# Altium schematic sheet Power.SchDoc (part 1 of 2)
size A4; SheetNumber: 3; SheetTotal: 7
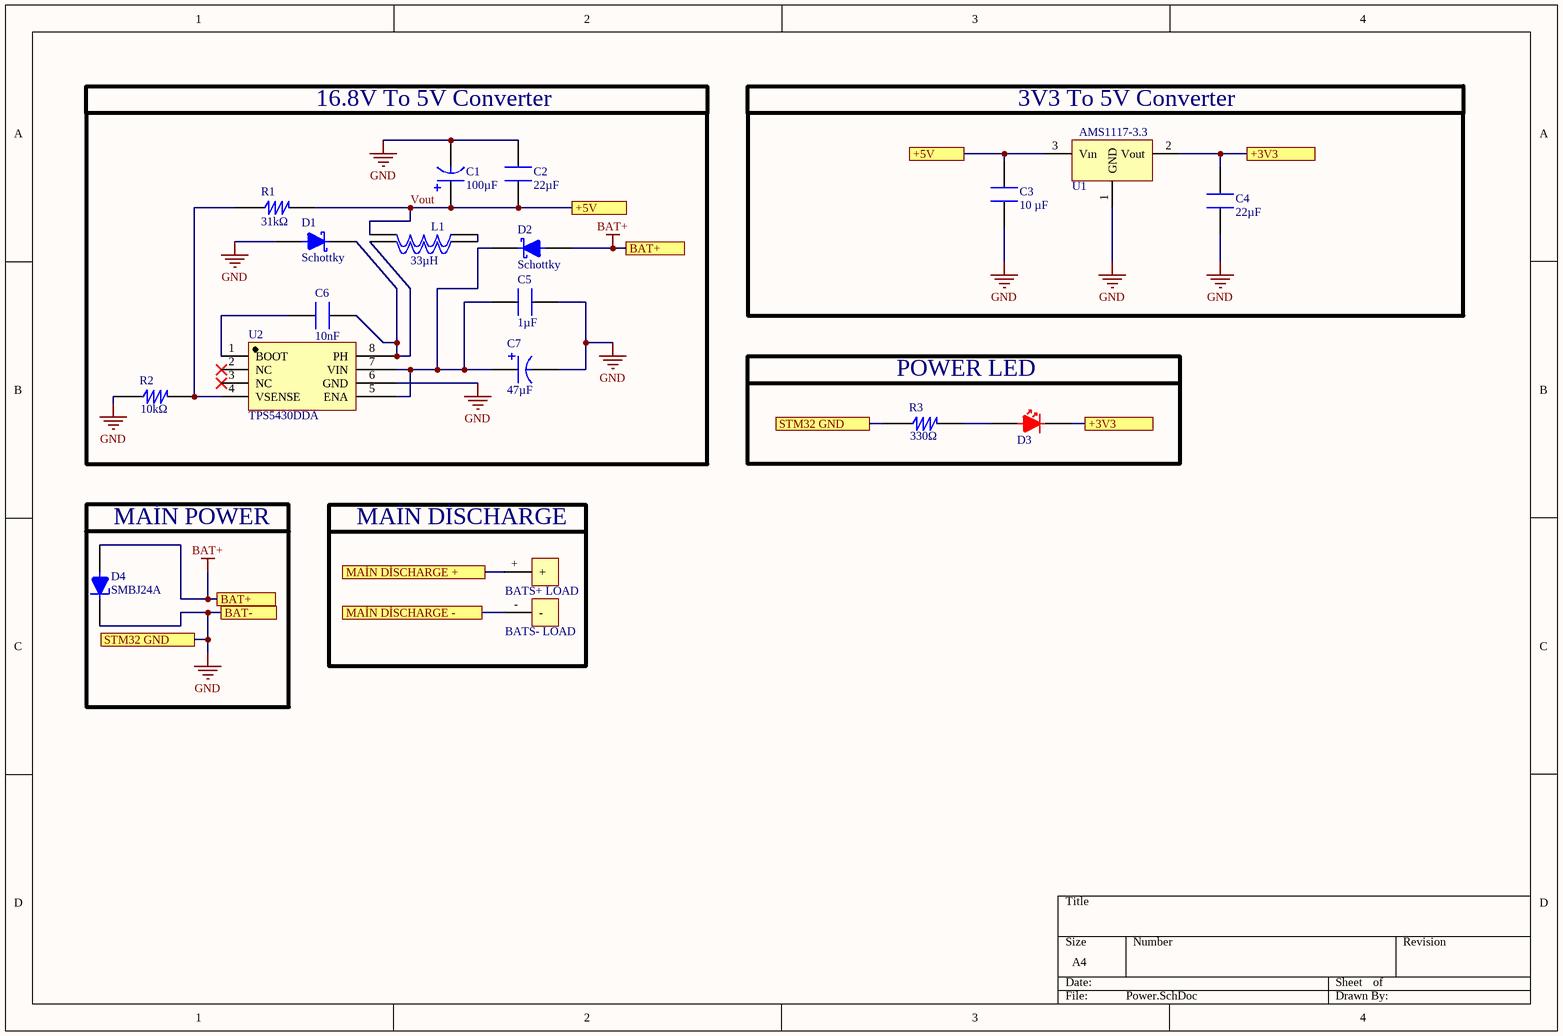
[diagram p0: Power.SchDoc]

## Parts
BATS+_LOAD  BATTERY + 1S  [BATTERY +1S]  (value not drawn)
BATS-_LOAD  BATTERY -1S  [BATTERY -1S]  (value not drawn)
C1  value 100µF  [CAP_EEE-1AA101WR]  (hidden comment: EEE-1AA101WR)
C2  value 22µF  [CAP CER 1210]  (hidden comment: C1210C226J8RACTU)
C3  Capacitance: 10 µF  [CAP CER 0805]  (hidden comment: 0805W106K500CC)
C4  value 22µF  [CAP CER 1210]  (hidden comment: C1210C226J8RACTU)
C5  value 1µF  [CAP CER 0805]  (hidden comment: CL21B105KBFNNNE)
C6  value 10nF  [CAP CER 0603]  (hidden comment: C0603C103J5RACTU)
C7  value 47µF  [CAP_EEE-FK1E470P]  (hidden comment: EEE-FK1E470P)
D1  Technology: Schottky  [DO-214AC (SMA)]  (hidden comment: SS54)
D2  Technology: Schottky  [DO-214AC (SMA)]  (hidden comment: SS54)
D3  LTST-C190KRKT  [LED 0603]  (value not drawn)
D4  SMBJ24A  [SMBJ24A]
L1  value 33µH  [SRF0703 Series INDUCTOR]  (hidden comment: SRF0703-330M)
R1  value 31kΩ  [RES 2010]  (hidden comment: Y162731K0000T9R)
R2  value 10kΩ  [RES 0603]  (hidden comment: RMCF0603FT10K0)
R3  value 330Ω  [RES 0603]  (hidden comment: CRG0603F330R)
U1  AMS1117-3.3  [SOT-223-3L]
U2  TPS5430DDA  [8SOPWR]

## Blocks framed on the sheet
16.8V To 5V Converter: C1 C2 C5-C7 D1 D2 L1 R1 R2 U2
3V3 To 5V Converter: C3 C4 U1
MAİN POWER: D4

## Ports
+3V3 (see COM[1C], COM[3C], COM[3D], COM[4B], ESP32 and Flash[2A], ESP32 and Flash[3A], MCU[2A], MCU[2B], MCU[3A], MCU[3B], MCU[3D], Power[3B]), +3V3 (see COM[1C], COM[3C], COM[3D], COM[4B], ESP32 and Flash[2A], ESP32 and Flash[3A], MCU[2A], MCU[2B], MCU[3A], MCU[3B], MCU[3D], Power[4A]), +5V (see COM[2D], Power[2A]), +5V (see COM[2D], Power[3A]), BAT+ (see AFE and MOSFETs[1B], AFE and MOSFETs[1C], AFE and MOSFETs[2B], Power[1C]), BAT+ (see AFE and MOSFETs[1B], AFE and MOSFETs[1C], AFE and MOSFETs[2B], Power[2A]), BAT- (see AFE and MOSFETs[2A]), MAİN DİSCHARGE + (see AFE and MOSFETs[4D]), MAİN DİSCHARGE - (see AFE and MOSFETs[3A]), STM32 GND (see COM[1B], COM[1D], COM[2C], COM[2D], COM[3B], COM[4D], ESP32 and Flash[2C], MCU[3A], MCU[3D], MCU[4B], Power[1C]), STM32 GND (see COM[1B], COM[1D], COM[2C], COM[2D], COM[3B], COM[4D], ESP32 and Flash[2C], MCU[3A], MCU[3D], MCU[4B], Power[2B])

## Nets
BAT+: D2.1 D4.1 ; port BAT+
GND: C1.2 C2.2 C3.2 C4.2 C5.2 C7.2 D1.1 D4.2 R2.1 R3.1 U1.1(GND) U2.6(GND) ; port STM32 GND, port BAT-
+3V3: C4.1 D3.2 U1.2(Vout) ; port +3V3
MAİN DİSCHARGE +: BATS+_LOAD.+ ; port MAİN DİSCHARGE +
MAİN DİSCHARGE -: BATS-_LOAD.- ; port MAİN DİSCHARGE -
Vout: C1.1 C2.1 C3.1 L1.1 R1.2 U1.3(Vın) ; port +5V
NetC5_1: C5.1 C7.1 D2.2 U2.5(ENA) U2.7(VIN)
NetC6_1: C6.1 D1.2 L1.2 U2.8(PH)
NetC6_2: C6.2 U2.1(BOOT)
NetD3_1: D3.1 R3.2
NetR1_1: R1.1 R2.2 U2.4(VSENSE)

Not connected (* = marked no-connect by the designer): L1 3; U2 2(NC)* 3(NC)*

## Notes on the sheet
- POWER LED
- (near BATS+_LOAD) MAİN DİSCHARGE
## Library data of the parts
BATS+_LOAD = BATTERY + 1S: battery + pad
BATS-_LOAD = BATTERY -1S: battery - pad
C1 = CAP ALUM 100UF 10V: CAP ALUM 100UF 20% 10V SMD; Manufacturer: Panasonic; Dissipation Factor: 30%; Leakage Current: 10µA; Life (Hours): 1000hours; Ripple Current: 50mA; Supplier: Arrow Electronics; Supplier Part Number: EEE-1AA101WR; Manufacturer Part Number: EEE-1AA101WR; RoHS: Compliant; Category: Aluminum Electrolytic Capacitors; Stock: 26000; Pricing: 1000=0,0647 (USD); Case/Package: Radial; Contact Plating: Tin; Diameter: 5mm; Height: 5.4mm; Height - Seated (Max): 5.4102mm; Lead Free: Lead Free; Length: 5.3mm; Lifecycle Status: NRND; Max Operating Temperature: 85°C; Min Operating Temperature: -40°C; Mounting Technology: Surface Mount; Number of Terminals: 2; Packaging: Cut Tape; Radiation Hardening: No; REACH SVHC: Yes; Ripple Current (AC): 50mA; Schedule B: 8532220020, 8532220020|8532220020|8532220020|8532220020|8532220020; Termination: SMD/SMT; Tolerance: 20%; Voltage Rating: 10V; Voltage Rating (DC): 10V; Width: 5.3mm; ComponentLink1URL: https://datasheet.octopart.com:443/EEE-1AA101WR-Panasonic-datasheet-62330071.pdf?src-supplier=Newark; ComponentLink1Description: https://datasheet.octopart.com:443/EEE-1AA101WR-Panasonic-datasheet-62330071.pdf?src-supplier=Newark; ComponentLink2URL: https://datasheet.octopart.com:443/EEE-1AA101WR-Panasonic-datasheet-5314063.pdf?src-supplier=Newark; ComponentLink2Description: https://datasheet.octopart.com:443/EEE-1AA101WR-Panasonic-datasheet-5314063.pdf?src-supplier=Newark; ComponentLink3URL: https://datasheet.octopart.com:443/EEE-1AA101WR-Panasonic-datasheet-41169183.pdf?src-supplier=Newark; ComponentLink3Description: https://datasheet.octopart.com:443/EEE-1AA101WR-Panasonic-datasheet-41169183.pdf?src-supplier=Newark; ComponentLink4URL: https://datasheet.octopart.com:443/EEE-1AA101WR-Panasonic-datasheet-13265900.pdf?src-supplier=RS+(Formerly+Allied+Electronics); ComponentLink4Description: https://datasheet.octopart.com:443/EEE-1AA101WR-Panasonic-datasheet-13265900.pdf?src-supplier=RS+(Formerly+Allied+Electronics); ComponentLink5URL: https://datasheet.octopart.com:443/EEE-1AA101WR-Panasonic-datasheet-34230028.pdf?src-supplier=element14+APAC; ComponentLink5Description: https://datasheet.octopart.com:443/EEE-1AA101WR-Panasonic-datasheet-34230028.pdf?src-supplier=element14+APAC; ComponentLink6URL: https://datasheet.octopart.com:443/EEE-1AA101WR-Panasonic-datasheet-154766114.pdf?src-supplier=Master+Electronics; ComponentLink6Description: https://datasheet.octopart.com:443/EEE-1AA101WR-Panasonic-datasheet-154766114.pdf?src-supplier=Master+Electronics; ComponentLink7URL: https://datasheet.octopart.com:443/EEE-1AA101WR-Panasonic-datasheet-11548988.pdf?src-supplier=Arrow+Electronics; ComponentLink7Description: https://datasheet.octopart.com:443/EEE-1AA101WR-Panasonic-datasheet-11548988.pdf?src-supplier=Arrow+Electronics; ComponentLink8URL: https://datasheet.octopart.com:443/EEE1AA101WR-Panasonic-datasheet-150469818.pdf?src-supplier=TME; ComponentLink8Description: https://datasheet.octopart.com:443/EEE1AA101WR-Panasonic-datasheet-150469818.pdf?src-supplier=TME; ComponentLink9URL: https://sigma.octopart.com:443/150570760/technical_drawing/Panasonic-EEE1AA101WR.pdf?src-supplier=Panasonic+SCT; ComponentLink9Description: https://sigma.octopart.com:443/150570760/technical_drawing/Panasonic-EEE1AA101WR.pdf?src-supplier=Panasonic+SCT; ComponentLink10URL: https://datasheet.octopart.com:443/EEE-1AA101WR-Panasonic-datasheet-6019.pdf?src-supplier=DigiKey; ComponentLink10Description: https://datasheet.octopart.com:443/EEE-1AA101WR-Panasonic-datasheet-6019.pdf?src-supplier=DigiKey
C2 C4 = CAP CER 22UF 10V 1210: CAP CER 22UF 10V X7R 1210; Manufacturer: KEMET; Dielectric Material: Ceramic; Tolerance: 5%; Supplier: Arrow Electronics; Supplier Part Number: C1210C226J8RACTU; Manufacturer Part Number: C1210C226J8RACTU; RoHS: Compliant; Category: Ceramic Capacitors; Pricing: 1000=2,466, 2000=2,456, 3000=2,445, 4000=2,434, 5000=2,422, 6000=2,411, 10000=2,4, 20000=2,388, 50000=2,376 (USD); Case/Package: 1210; China RoHS: Compliant; Dielectric: X7R; Height: 2.5mm; Length: 3.2mm; Lifecycle Status: Production; Max Operating Temperature: 125°C; Min Operating Temperature: -55°C; Mounting Technology: Surface Mount; Number of Terminals: 2; REACH SVHC: Yes; Voltage Rating (DC): 10V; Width: 2.5mm; ComponentLink1URL: https://datasheet.octopart.com:443/C1210C226J8RACTU-KEMET-datasheet-178445679.pdf?src-supplier=IHS; ComponentLink1Description: https://datasheet.octopart.com:443/C1210C226J8RACTU-KEMET-datasheet-178445679.pdf?src-supplier=IHS; ComponentLink2URL: https://datasheet.octopart.com/C1210C226J8RACTU-KEMET-datasheet-84169754.pdf; ComponentLink2Description: https://datasheet.octopart.com/C1210C226J8RACTU-KEMET-datasheet-84169754.pdf
C3 = CAP CER 10UF 50V 0805: 10 µF ±10% 50V Ceramic Capacitor X5R 0805 (2012 Metric); Series: 0805; Voltage - Rated: 50V; Tolerance: ±10%; Temperature Coefficient: X5R; Operating Temperature: -55°C ~ 85°C; Mounting Type: Surface Mount, MLCC; Package / Case: 0805 (2012 Metric); Size / Dimension: 0.079" L x 0.049" W (2.00mm x 1.25mm); Thickness (Max): 0.057" (1.45mm); ComponentLink1Description: Datasheet; ComponentLink1URL: https://mm.digikey.com/Volume0/opasdata/d220001/medias/docus/5660/3372_0805W106K500CC.pdf; ComponentLink2Description: Supplier Link; ComponentLink2URL: https://www.digikey.com/en/products/detail/nextgen-components/0805W106K500CC/18677029
C5 = CAP CER 1UF 50V 0805: CAP CER 1UF 50V X7R 0805; Manufacturer: Samsung Electro-Mechanics; Dielectric Material: Ceramic; Tolerance: 10%; Supplier: Arrow Electronics; Supplier Part Number: CL21B105KBFNNNE; Manufacturer Part Number: CL21B105KBFNNNE; RoHS: Compliant; Category: Ceramic Capacitors; Stock: 4546000; Pricing: 10000=0,0106 (USD); Case/Package: 0805; Case Code (Imperial): 0805; Case Code (Metric): 2012; China RoHS: Compliant; Depth: 1.25mm; Dielectric: X7R; Height: 1.35mm; Length: 2mm; Lifecycle Status: Production; Material: Ceramic; Max Operating Temperature: 125°C; Min Operating Temperature: -55°C; Mounting Technology: Surface Mount; Number of Terminals: 2; Radiation Hardening: No; REACH SVHC: Yes; Schedule B: 8532240020, 8532240020|8532240020, 8532240020|8532240020|8532240020, 8532240020|8532240020|8532240020|8532240020; Thickness: 1.3462mm; Voltage: 50V; Voltage Rating: 50V; Voltage Rating (DC): 50V; Width: 1.25mm; ComponentLink1URL: https://datasheet.octopart.com:443/CL21B105KBFNNNE-Samsung-Electro-Mechanics-datasheet-136482495.pdf?src-supplier=IHS; ComponentLink1Description: https://datasheet.octopart.com:443/CL21B105KBFNNNE-Samsung-Electro-Mechanics-datasheet-136482495.pdf?src-supplier=IHS; ComponentLink2URL: https://datasheet.octopart.com:443/CL21B105KBFNNNE-Samsung-Electro-Mechanics-datasheet-11733377.pdf?src-supplier=Future+Electronics; ComponentLink2Description: https://datasheet.octopart.com:443/CL21B105KBFNNNE-Samsung-Electro-Mechanics-datasheet-11733377.pdf?src-supplier=Future+Electronics; ComponentLink3URL: https://datasheet.octopart.com:443/CL21B105KBFNNNE-Samsung-Electro-Mechanics-datasheet-116891038.pdf?src-supplier=Future+Electronics; ComponentLink3Description: https://datasheet.octopart.com:443/CL21B105KBFNNNE-Samsung-Electro-Mechanics-datasheet-116891038.pdf?src-supplier=Future+Electronics; ComponentLink4URL: https://datasheet.octopart.com:443/CL21B105KBFNNNE-Samsung-Electro-Mechanics-datasheet-81462183.pdf?src-supplier=Future+Electronics; ComponentLink4Description: https://datasheet.octopart.com:443/CL21B105KBFNNNE-Samsung-Electro-Mechanics-datasheet-81462183.pdf?src-supplier=Future+Electronics; ComponentLink5URL: https://datasheet.octopart.com:443/CL21B105KBFNNNE-Samsung-datasheet-48647582.pdf?src-supplier=Future+Electronics; ComponentLink5Description: https://datasheet.octopart.com:443/CL21B105KBFNNNE-Samsung-datasheet-48647582.pdf?src-supplier=Future+Electronics; ComponentLink6URL: https://datasheet.octopart.com:443/CL21B105KBFNNNE-Samsung-datasheet-8326294.pdf?src-supplier=Future+Electronics; ComponentLink6Description: https://datasheet.octopart.com:443/CL21B105KBFNNNE-Samsung-datasheet-8326294.pdf?src-supplier=Future+Electronics; ComponentLink7URL: https://datasheet.octopart.com:443/CL21B105KBFNNNE-Samsung-Electro-Mechanics-datasheet-149045959.pdf?src-supplier=Future+Electronics; ComponentLink7Description: https://datasheet.octopart.com:443/CL21B105KBFNNNE-Samsung-Electro-Mechanics-datasheet-149045959.pdf?src-supplier=Future+Electronics; ComponentLink8URL: https://datasheet.octopart.com/CL21B105KBFNNNE-Samsung-Electro-Mechanics-datasheet-97040617.pdf; ComponentLink8Description: https://datasheet.octopart.com/CL21B105KBFNNNE-Samsung-Electro-Mechanics-datasheet-97040617.pdf; ComponentLink9URL: https://datasheet.octopart.com/CL21B105KBFNNNE-Samsung-Electro-Mechanics-datasheet-8324245.pdf; ComponentLink9Description: https://datasheet.octopart.com/CL21B105KBFNNNE-Samsung-Electro-Mechanics-datasheet-8324245.pdf; ComponentLink10URL: https://datasheet.octopart.com/General-Multilayer-Ceramic-Capacitors-Samsung-datasheet-family-111.pdf; ComponentLink10Description: https://datasheet.octopart.com/General-Multilayer-Ceramic-Capacitors-Samsung-datasheet-family-111.pdf; ComponentLink11URL: https://datasheet.octopart.com:443/CL21B105KBFNNNE-Samsung-datasheet-59220082.pdf?src-supplier=TME; ComponentLink11Description: https://datasheet.octopart.com:443/CL21B105KBFNNNE-Samsung-datasheet-59220082.pdf?src-supplier=TME; ComponentLink12URL: http://sigma.octopart.com:80/rohs_certificate/General-Multilayer-Ceramic-Capacitors-Samsung-family-110.pdf?src-supplier=Compliance+Statements; ComponentLink12Description: http://sigma.octopart.com:80/rohs_certificate/General-Multilayer-Ceramic-Capacitors-Samsung-family-110.pdf?src-supplier=Compliance+Statements; ComponentLink13URL: http://sigma.octopart.com:80/rohs_statement/General-Multilayer-Ceramic-Capacitors-Samsung-family-132.pdf?src-supplier=Compliance+Statements; ComponentLink13Description: http://sigma.octopart.com:80/rohs_statement/General-Multilayer-Ceramic-Capacitors-Samsung-family-132.pdf?src-supplier=Compliance+Statements; ComponentLink14URL: http://sigma.octopart.com:80/reach_statement/General-Multilayer-Ceramic-Capacitors-Samsung-family-133.pdf?src-supplier=Compliance+Statements; ComponentLink14Description: http://sigma.octopart.com:80/reach_statement/General-Multilayer-Ceramic-Capacitors-Samsung-family-133.pdf?src-supplier=Compliance+Statements
C6 = CAP CER 0.01µF (10 nF) 50V 0603: CAP CER 10000PF 50V X7R 0603; Manufacturer: KEMET; Dielectric Material: Ceramic; Dissipation Factor: 2.5%; Temperature Coefficient: 30ppm/°C; Tolerance: 5%; Supplier: Arrow Electronics; Supplier Part Number: C0603C103J5RACTU; Manufacturer Part Number: C0603C103J5RACTU; RoHS: Compliant; Category: Ceramic Capacitors; Stock: 896000; Pricing: 20000=0,0043 (USD); Case/Package: 0603; Case Code (Imperial): 0603; China RoHS: Compliant; Contact Plating: Tin; Depth: 800µm; Dielectric: X7R; Height: 800µm; Lead Free: Lead Free; Lead Pitch: 700µm; Length: 1.6mm; Lifecycle Status: Production; Material: Ceramic; Max Operating Temperature: 125°C; Min Operating Temperature: -55°C; Mounting Technology: Surface Mount; Pins: 2; Number of Terminals: 2; Packaging: Cut Tape; Radiation Hardening: No; REACH SVHC: Yes; Schedule B: 8532240020, 8532240020|8532240020, 8532240020|8532240020|8532240020, 8532240020|8532240020|8532240020|8532240020; Termination: SMD/SMT; Thickness: 863.6µm; Voltage: 50V; Voltage Rating: 50V; Voltage Rating (DC): 50V; Width: 800µm; ComponentLink1URL: https://datasheet.octopart.com:443/C0603C103J5RAC7867-KEMET-datasheet-179096189.pdf?src-supplier=IHS; ComponentLink1Description: https://datasheet.octopart.com:443/C0603C103J5RAC7867-KEMET-datasheet-179096189.pdf?src-supplier=IHS; ComponentLink2URL: https://datasheet.octopart.com:443/C0603C103J5RACTU-KEMET-datasheet-178445679.pdf?src-supplier=IHS; ComponentLink2Description: https://datasheet.octopart.com:443/C0603C103J5RACTU-KEMET-datasheet-178445679.pdf?src-supplier=IHS; ComponentLink3URL: https://datasheet.octopart.com:443/C0603C103J5RACTU-KEMET-datasheet-137357759.pdf?src-supplier=Upverter; ComponentLink3Description: https://datasheet.octopart.com:443/C0603C103J5RACTU-KEMET-datasheet-137357759.pdf?src-supplier=Upverter; ComponentLink4URL: https://datasheet.octopart.com:443/C0603C103J5RACTU-KEMET-datasheet-137357764.pdf?src-supplier=Upverter; ComponentLink4Description: https://datasheet.octopart.com:443/C0603C103J5RACTU-KEMET-datasheet-137357764.pdf?src-supplier=Upverter; ComponentLink5URL: https://datasheet.octopart.com:443/C0603C103J5RAC-TU-Kemet-datasheet-5313890.pdf?src-supplier=Newark; ComponentLink5Description: https://datasheet.octopart.com:443/C0603C103J5RAC-TU-Kemet-datasheet-5313890.pdf?src-supplier=Newark; ComponentLink6URL: https://datasheet.octopart.com:443/C0603C103J5RAC-TU-Kemet-datasheet-5390537.pdf?src-supplier=Newark; ComponentLink6Description: https://datasheet.octopart.com:443/C0603C103J5RAC-TU-Kemet-datasheet-5390537.pdf?src-supplier=Newark; ComponentLink7URL: https://datasheet.octopart.com:443/C0603C103J5RAC-TU-Kemet-datasheet-7541751.pdf?src-supplier=Newark; ComponentLink7Description: https://datasheet.octopart.com:443/C0603C103J5RAC-TU-Kemet-datasheet-7541751.pdf?src-supplier=Newark; ComponentLink8URL: https://datasheet.octopart.com:443/C0603C103J5RACTU-KEMET-datasheet-176289383.pdf?src-supplier=Newark; ComponentLink8Description: https://datasheet.octopart.com:443/C0603C103J5RACTU-KEMET-datasheet-176289383.pdf?src-supplier=Newark; ComponentLink9URL: https://datasheet.octopart.com:443/C0603C103J5RACTU-KEMET-datasheet-130256537.pdf?src-supplier=Newark; ComponentLink9Description: https://datasheet.octopart.com:443/C0603C103J5RACTU-KEMET-datasheet-130256537.pdf?src-supplier=Newark; ComponentLink10URL: https://datasheet.octopart.com:443/C0603C103J5RACTU-Kemet-datasheet-8764837.pdf?src-supplier=Newark; ComponentLink10Description: https://datasheet.octopart.com:443/C0603C103J5RACTU-Kemet-datasheet-8764837.pdf?src-supplier=Newark; ComponentLink11URL: https://datasheet.octopart.com:443/C0603C103J5RACTU-Kemet-datasheet-8480123.pdf?src-supplier=Newark; ComponentLink11Description: https://datasheet.octopart.com:443/C0603C103J5RACTU-Kemet-datasheet-8480123.pdf?src-supplier=Newark; ComponentLink12URL: https://datasheet.octopart.com:443/C0603C103J5RACTU-Kemet-datasheet-5393970.pdf?src-supplier=Newark; ComponentLink12Description: https://datasheet.octopart.com:443/C0603C103J5RACTU-Kemet-datasheet-5393970.pdf?src-supplier=Newark; ComponentLink13URL: https://datasheet.octopart.com:443/C0603C103J5RACTU-Kemet-datasheet-8502025.pdf?src-supplier=Newark; ComponentLink13Description: https://datasheet.octopart.com:443/C0603C103J5RACTU-Kemet-datasheet-8502025.pdf?src-supplier=Newark; ComponentLink14URL: https://datasheet.octopart.com:443/C0603C103J5RACTU-Kemet-datasheet-161801.pdf?src-supplier=Newark; ComponentLink14Description: https://datasheet.octopart.com:443/C0603C103J5RACTU-Kemet-datasheet-161801.pdf?src-supplier=Newark; ComponentLink15URL: https://datasheet.octopart.com:443/C0603C103J5RACTU-KEMET-datasheet-149521810.pdf?src-supplier=Farnell; ComponentLink15Description: https://datasheet.octopart.com:443/C0603C103J5RACTU-KEMET-datasheet-149521810.pdf?src-supplier=Farnell; ComponentLink16URL: https://datasheet.octopart.com:443/C0603C103J5RACTU-Kemet-datasheet-12608295.pdf?src-supplier=Farnell; ComponentLink16Description: https://datasheet.octopart.com:443/C0603C103J5RACTU-Kemet-datasheet-12608295.pdf?src-supplier=Farnell; ComponentLink17URL: https://datasheet.octopart.com:443/C0603C103J5RACTU-Kemet-datasheet-11992184.pdf?src-supplier=Farnell; ComponentLink17Description: https://datasheet.octopart.com:443/C0603C103J5RACTU-Kemet-datasheet-11992184.pdf?src-supplier=Farnell; ComponentLink18URL: https://datasheet.octopart.com:443/C0603C103J5RACTU-Kemet-datasheet-10942409.pdf?src-supplier=Farnell; ComponentLink18Description: https://datasheet.octopart.com:443/C0603C103J5RACTU-Kemet-datasheet-10942409.pdf?src-supplier=Farnell; ComponentLink19URL: https://datasheet.octopart.com:443/C0603C103J5RACTU-Kemet-datasheet-10404442.pdf?src-supplier=Farnell; ComponentLink19Description: https://datasheet.octopart.com:443/C0603C103J5RACTU-Kemet-datasheet-10404442.pdf?src-supplier=Farnell; ComponentLink20URL: https://datasheet.octopart.com:443/C0603C103J5RACTU-KEMET-datasheet-101575638.pdf?src-supplier=Farnell; ComponentLink20Description: https://datasheet.octopart.com:443/C0603C103J5RACTU-KEMET-datasheet-101575638.pdf?src-supplier=Farnell; ComponentLink21URL: https://datasheet.octopart.com:443/C0603C103J5RAC-TU-Kemet-datasheet-7833651.pdf?src-supplier=Farnell; ComponentLink21Description: https://datasheet.octopart.com:443/C0603C103J5RAC-TU-Kemet-datasheet-7833651.pdf?src-supplier=Farnell; ComponentLink22URL: https://datasheet.octopart.com:443/C0603C103J5RAC-TU-Kemet-datasheet-7601896.pdf?src-supplier=Farnell; ComponentLink22Description: https://datasheet.octopart.com:443/C0603C103J5RAC-TU-Kemet-datasheet-7601896.pdf?src-supplier=Farnell; ComponentLink23URL: https://datasheet.octopart.com:443/C0603C103J5RAC-TU-Kemet-datasheet-5316294.pdf?src-supplier=Farnell; ComponentLink23Description: https://datasheet.octopart.com:443/C0603C103J5RAC-TU-Kemet-datasheet-5316294.pdf?src-supplier=Farnell; ComponentLink24URL: https://datasheet.octopart.com:443/C0603C103J5RAC-TU-Kemet-datasheet-5314837.pdf?src-supplier=Farnell; ComponentLink24Description: https://datasheet.octopart.com:443/C0603C103J5RAC-TU-Kemet-datasheet-5314837.pdf?src-supplier=Farnell; ComponentLink25URL: https://datasheet.octopart.com:443/C0603C103J5RAC-TU-Kemet-datasheet-8092359.pdf?src-supplier=Farnell; ComponentLink25Description: https://datasheet.octopart.com:443/C0603C103J5RAC-TU-Kemet-datasheet-8092359.pdf?src-supplier=Farnell; ComponentLink26URL: https://datasheet.octopart.com:443/C0603C103J5RAC-TU-Kemet-datasheet-5314449.pdf?src-supplier=Farnell; ComponentLink26Description: https://datasheet.octopart.com:443/C0603C103J5RAC-TU-Kemet-datasheet-5314449.pdf?src-supplier=Farnell; ComponentLink27URL: https://datasheet.octopart.com:443/C0603C103J5RAC-TU-Kemet-datasheet-5314969.pdf?src-supplier=Farnell; ComponentLink27Description: https://datasheet.octopart.com:443/C0603C103J5RAC-TU-Kemet-datasheet-5314969.pdf?src-supplier=Farnell; ComponentLink28URL: https://datasheet.octopart.com:443/C0603C103J5RAC-TU-Kemet-datasheet-5314627.pdf?src-supplier=Farnell; ComponentLink28Description: https://datasheet.octopart.com:443/C0603C103J5RAC-TU-Kemet-datasheet-5314627.pdf?src-supplier=Farnell; ComponentLink29URL: https://datasheet.octopart.com:443/C0603C103J5RAC-TU-Kemet-datasheet-5389132.pdf?src-supplier=Farnell; ComponentLink29Description: https://datasheet.octopart.com:443/C0603C103J5RAC-TU-Kemet-datasheet-5389132.pdf?src-supplier=Farnell; ComponentLink30URL: https://datasheet.octopart.com:443/C0603C103J5RAC-TU-Kemet-datasheet-5313836.pdf?src-supplier=Farnell; ComponentLink30Description: https://datasheet.octopart.com:443/C0603C103J5RAC-TU-Kemet-datasheet-5313836.pdf?src-supplier=Farnell; ComponentLink31URL: https://datasheet.octopart.com:443/C0603C103J5RAC-TU-Kemet-datasheet-8111010.pdf?src-supplier=Farnell; ComponentLink31Description: https://datasheet.octopart.com:443/C0603C103J5RAC-TU-Kemet-datasheet-8111010.pdf?src-supplier=Farnell; ComponentLink32URL: https://datasheet.octopart.com:443/C0603C103J5RAC-TU-Kemet-datasheet-7627733.pdf?src-supplier=Farnell; ComponentLink32Description: https://datasheet.octopart.com:443/C0603C103J5RAC-TU-Kemet-datasheet-7627733.pdf?src-supplier=Farnell; ComponentLink33URL: https://datasheet.octopart.com:443/C0603C103J5RAC-TU-Kemet-datasheet-5315946.pdf?src-supplier=Farnell; ComponentLink33Description: https://datasheet.octopart.com:443/C0603C103J5RAC-TU-Kemet-datasheet-5315946.pdf?src-supplier=Farnell; ComponentLink34URL: https://datasheet.octopart.com:443/C0603C103J5RACTU-Kemet-datasheet-32036385.pdf?src-supplier=Electro+Sonic; ComponentLink34Description: https://datasheet.octopart.com:443/C0603C103J5RACTU-Kemet-datasheet-32036385.pdf?src-supplier=Electro+Sonic; ComponentLink35URL: https://datasheet.octopart.com:443/C0603C103J5RACTU-KEMET-datasheet-157246124.pdf?src-supplier=Electro+Sonic; ComponentLink35Description: https://datasheet.octopart.com:443/C0603C103J5RACTU-KEMET-datasheet-157246124.pdf?src-supplier=Electro+Sonic; ComponentLink36URL: https://datasheet.octopart.com:443/C0603C103J5RACTU-KEMET-datasheet-164512540.pdf?src-supplier=TME; ComponentLink36Description: https://datasheet.octopart.com:443/C0603C103J5RACTU-KEMET-datasheet-164512540.pdf?src-supplier=TME; ComponentLink37URL: https://datasheet.octopart.com:443/C0603C103J5RACTU-KEMET-datasheet-96931484.pdf?src-supplier=TME; ComponentLink37Description: https://datasheet.octopart.com:443/C0603C103J5RACTU-KEMET-datasheet-96931484.pdf?src-supplier=TME; ComponentLink38URL: https://datasheet.octopart.com:443/C0603C103J5RACTU-KEMET-datasheet-68331906.pdf?src-supplier=TME; ComponentLink38Description: https://datasheet.octopart.com:443/C0603C103J5RACTU-KEMET-datasheet-68331906.pdf?src-supplier=TME; ComponentLink39URL: https://datasheet.octopart.com:443/C0603C103J5RACTU-KEMET-datasheet-160663178.pdf?src-supplier=JRH+Electronics; ComponentLink39Description: https://datasheet.octopart.com:443/C0603C103J5RACTU-KEMET-datasheet-160663178.pdf?src-supplier=JRH+Electronics; ComponentLink40URL: https://datasheet.octopart.com:443/C0603C103J5RACTU-KEMET-datasheet-110724412.pdf?src-supplier=RS+(Formerly+Allied+Electronics); ComponentLink40Description: https://datasheet.octopart.com:443/C0603C103J5RACTU-KEMET-datasheet-110724412.pdf?src-supplier=RS+(Formerly+Allied+Electronics); ComponentLink41URL: https://datasheet.octopart.com:443/C0603C103J5RACTU-Kemet-datasheet-464.pdf?src-supplier=RS+(Formerly+Allied+Electronics); ComponentLink41Description: https://datasheet.octopart.com:443/C0603C103J5RACTU-Kemet-datasheet-464.pdf?src-supplier=RS+(Formerly+Allied+Electronics); ComponentLink42URL: https://datasheet.octopart.com/C0603C103J5RACTU-KEMET-datasheet-84169754.pdf; ComponentLink42Description: https://datasheet.octopart.com/C0603C103J5RACTU-KEMET-datasheet-84169754.pdf; ComponentLink43URL: https://datasheet.octopart.com:443/C0603C103J5RACTU-Kemet-datasheet-24570007.pdf?src-supplier=element14+APAC; ComponentLink43Description: https://datasheet.octopart.com:443/C0603C103J5RACTU-Kemet-datasheet-24570007.pdf?src-supplier=element14+APAC; ComponentLink44URL: https://datasheet.octopart.com:443/C0603C103J5RACTU-Kemet-datasheet-22084244.pdf?src-supplier=element14+APAC; ComponentLink44Description: https://datasheet.octopart.com:443/C0603C103J5RACTU-Kemet-datasheet-22084244.pdf?src-supplier=element14+APAC; ComponentLink45URL: https://datasheet.octopart.com:443/C0603C103J5RACTU-Kemet-datasheet-11807495.pdf?src-supplier=Arrow+Electronics; ComponentLink45Description: https://datasheet.octopart.com:443/C0603C103J5RACTU-Kemet-datasheet-11807495.pdf?src-supplier=Arrow+Electronics; ComponentLink46URL: https://datasheet.octopart.com:443/C0603C103J5RAC-TU-Kemet-datasheet-7275486.pdf?src-supplier=Jameco; ComponentLink46Description: https://datasheet.octopart.com:443/C0603C103J5RAC-TU-Kemet-datasheet-7275486.pdf?src-supplier=Jameco
C7 = CAP ALUM 47UF 25V: Radial Can - SMD ALUMINUM ELECTROLYTIC CAPACITOR FK 25V 47muF ±20% 0.248Dia 6.30mm; Manufacturer: Panasonic; Manufacturer Part Number: EEEFK1E470P; Dielectric Material: Aluminium; Dissipation Factor: 14%; ESR (Equivalent Series Resistance): 360mΩ; Leakage Current: 11.75µA; Life (Hours): 2000hours; Polarity: Polar; Ripple Current: 180mA; Ripple Current (AC): 240mA; Supplier: Arrow Electronics; Supplier Part Number: EEE-FK1E470P; RoHS: Compliant; Category: Aluminum Electrolytic Capacitors; Stock: 18000; Pricing: 1000=0,0922, 2000=0,091, 3000=0,09, 4000=0,086, 5000=0,085, 10000=0,08 (USD); Case/Package: Radial; Contact Plating: Tin; Diameter: 6.3mm; Height: 5.8mm; Height - Seated (Max): 6.096mm; Impedance: 360mΩ; Lead Free: Lead Free; Length: 6.6mm; Lifecycle Status: Production; Max Operating Temperature: 105°C; Min Operating Temperature: -55°C; Mounting Technology: Surface Mount; Pins: 2; Number of Terminals: 2; Packaging: Cut Tape; Radiation Hardening: No; REACH SVHC: Yes; Schedule B: 8532220020, 8532220020|8532220020|8532220020|8532220020|8532220020|8532220020|8532220020|8532220020|8532220020|8532220020|8532220020|8532220020|8532220020|8532220020|8532220020|8532220020|8532220020|8532220020|8532220020|8532220020|8532220020|8532220020|8532220020|85; Termination: SMD/SMT; Tolerance: 20%; Voltage: 25V; Voltage Rating: 25V; Voltage Rating (AC): 25V; Voltage Rating (DC): 25V; Width: 6.6mm; ComponentLink1URL: https://datasheet.octopart.com:443/EEEFK1E470P-Panasonic-datasheet-169278531.pdf?src-supplier=IHS; ComponentLink1Description: https://datasheet.octopart.com:443/EEEFK1E470P-Panasonic-datasheet-169278531.pdf?src-supplier=IHS; ComponentLink2URL: https://datasheet.octopart.com:443/EEEFK1E470P-Panasonic-datasheet-62287436.pdf?src-supplier=Newark; ComponentLink2Description: https://datasheet.octopart.com:443/EEEFK1E470P-Panasonic-datasheet-62287436.pdf?src-supplier=Newark; ComponentLink3URL: https://datasheet.octopart.com:443/EEEFK1E470P-Panasonic-datasheet-8161.pdf?src-supplier=Newark; ComponentLink3Description: https://datasheet.octopart.com:443/EEEFK1E470P-Panasonic-datasheet-8161.pdf?src-supplier=Newark; ComponentLink4URL: https://datasheet.octopart.com:443/EEEFK1E470P-Panasonic-datasheet-61627622.pdf?src-supplier=Newark; ComponentLink4Description: https://datasheet.octopart.com:443/EEEFK1E470P-Panasonic-datasheet-61627622.pdf?src-supplier=Newark; ComponentLink5URL: https://datasheet.octopart.com:443/EEEFK1E470P-Panasonic-datasheet-8852369.pdf?src-supplier=Newark; ComponentLink5Description: https://datasheet.octopart.com:443/EEEFK1E470P-Panasonic-datasheet-8852369.pdf?src-supplier=Newark; ComponentLink6URL: https://datasheet.octopart.com:443/EEEFK1E470P-Panasonic-datasheet-8712906.pdf?src-supplier=Newark; ComponentLink6Description: https://datasheet.octopart.com:443/EEEFK1E470P-Panasonic-datasheet-8712906.pdf?src-supplier=Newark; ComponentLink7URL: https://datasheet.octopart.com:443/EEEFK1E470P-Panasonic-datasheet-13278598.pdf?src-supplier=Newark; ComponentLink7Description: https://datasheet.octopart.com:443/EEEFK1E470P-Panasonic-datasheet-13278598.pdf?src-supplier=Newark; ComponentLink8URL: https://datasheet.octopart.com:443/EEE-FK1E470P-Panasonic-datasheet-22087609.pdf?src-supplier=Newark; ComponentLink8Description: https://datasheet.octopart.com:443/EEE-FK1E470P-Panasonic-datasheet-22087609.pdf?src-supplier=Newark; ComponentLink9URL: https://datasheet.octopart.com:443/EEEFK1E470P-Panasonic-datasheet-13266987.pdf?src-supplier=RS+(Formerly+Allied+Electronics); ComponentLink9Description: https://datasheet.octopart.com:443/EEEFK1E470P-Panasonic-datasheet-13266987.pdf?src-supplier=RS+(Formerly+Allied+Electronics); ComponentLink10URL: https://datasheet.octopart.com:443/EEEFK1E470P-Panasonic-datasheet-8854493.pdf?src-supplier=Future+Electronics; ComponentLink10Description: https://datasheet.octopart.com:443/EEEFK1E470P-Panasonic-datasheet-8854493.pdf?src-supplier=Future+Electronics; ComponentLink11URL: https://datasheet.octopart.com:443/EEEFK1E470P-Panasonic-datasheet-8711795.pdf?src-supplier=Future+Electronics; ComponentLink11Description: https://datasheet.octopart.com:443/EEEFK1E470P-Panasonic-datasheet-8711795.pdf?src-supplier=Future+Electronics; ComponentLink12URL: https://datasheet.octopart.com:443/EEEFK1E470P-Panasonic-datasheet-5313801.pdf?src-supplier=Future+Electronics; ComponentLink12Description: https://datasheet.octopart.com:443/EEEFK1E470P-Panasonic-datasheet-5313801.pdf?src-supplier=Future+Electronics; ComponentLink13URL: https://datasheet.octopart.com:443/EEE-FK1E470P-Panasonic-datasheet-150469824.pdf?src-supplier=JRH+Electronics; ComponentLink13Description: https://datasheet.octopart.com:443/EEE-FK1E470P-Panasonic-datasheet-150469824.pdf?src-supplier=JRH+Electronics; ComponentLink14URL: https://datasheet.octopart.com:443/EEE-FK1E470P-Panasonic-datasheet-11546739.pdf?src-supplier=Electro+Sonic; ComponentLink14Description: https://datasheet.octopart.com:443/EEE-FK1E470P-Panasonic-datasheet-11546739.pdf?src-supplier=Electro+Sonic; ComponentLink15URL: https://datasheet.octopart.com:443/EEEFK1E470P-Panasonic-datasheet-7555708.pdf?src-supplier=Jameco; ComponentLink15Description: https://datasheet.octopart.com:443/EEEFK1E470P-Panasonic-datasheet-7555708.pdf?src-supplier=Jameco; ComponentLink16URL: https://sigma.octopart.com:443/150570760/technical_drawing/Panasonic-EEEFK1E470P.pdf?src-supplier=Panasonic+SCT; ComponentLink16Description: https://sigma.octopart.com:443/150570760/technical_drawing/Panasonic-EEEFK1E470P.pdf?src-supplier=Panasonic+SCT; ComponentLink17URL: https://datasheet.octopart.com:443/EEEFK1E470P-Panasonic-datasheet-136531309.pdf?src-supplier=TME; ComponentLink17Description: https://datasheet.octopart.com:443/EEEFK1E470P-Panasonic-datasheet-136531309.pdf?src-supplier=TME; ComponentLink18URL: https://datasheet.octopart.com:443/EEEFK1E470P-Panasonic-datasheet-136348055.pdf?src-supplier=TME; ComponentLink18Description: https://datasheet.octopart.com:443/EEEFK1E470P-Panasonic-datasheet-136348055.pdf?src-supplier=TME; ComponentLink19URL: https://datasheet.octopart.com:443/EEEFK1E470P-Panasonic-datasheet-5318435.pdf?src-supplier=Farnell; ComponentLink19Description: https://datasheet.octopart.com:443/EEEFK1E470P-Panasonic-datasheet-5318435.pdf?src-supplier=Farnell; ComponentLink20URL: https://datasheet.octopart.com:443/EEEFK1E470P-Panasonic-datasheet-5316599.pdf?src-supplier=Farnell; ComponentLink20Description: https://datasheet.octopart.com:443/EEEFK1E470P-Panasonic-datasheet-5316599.pdf?src-supplier=Farnell; ComponentLink21URL: https://datasheet.octopart.com:443/EEEFK1E470P-Panasonic-datasheet-5390910.pdf?src-supplier=Farnell; ComponentLink21Description: https://datasheet.octopart.com:443/EEEFK1E470P-Panasonic-datasheet-5390910.pdf?src-supplier=Farnell; ComponentLink22URL: https://datasheet.octopart.com:443/EEEFK1E470P-Panasonic-datasheet-7550061.pdf?src-supplier=Farnell; ComponentLink22Description: https://datasheet.octopart.com:443/EEEFK1E470P-Panasonic-datasheet-7550061.pdf?src-supplier=Farnell; ComponentLink23URL: https://datasheet.octopart.com:443/EEEFK1E470P-Panasonic-datasheet-1770.pdf?src-supplier=Farnell; ComponentLink23Description: https://datasheet.octopart.com:443/EEEFK1E470P-Panasonic-datasheet-1770.pdf?src-supplier=Farnell; ComponentLink24URL: https://datasheet.octopart.com:443/EEEFK1E470P-Panasonic-datasheet-1290.pdf?src-supplier=Farnell; ComponentLink24Description: https://datasheet.octopart.com:443/EEEFK1E470P-Panasonic-datasheet-1290.pdf?src-supplier=Farnell; ComponentLink25URL: https://datasheet.octopart.com:443/EEEFK1E470P-Panasonic-datasheet-2601.pdf?src-supplier=Farnell; ComponentLink25Description: https://datasheet.octopart.com:443/EEEFK1E470P-Panasonic-datasheet-2601.pdf?src-supplier=Farnell; ComponentLink26URL: https://datasheet.octopart.com:443/EEEFK1E470P-Panasonic-datasheet-122249.pdf?src-supplier=Farnell; ComponentLink26Description: https://datasheet.octopart.com:443/EEEFK1E470P-Panasonic-datasheet-122249.pdf?src-supplier=Farnell; ComponentLink27URL: https://datasheet.octopart.com:443/EEEFK1E470P-Panasonic-datasheet-4056.pdf?src-supplier=Farnell; ComponentLink27Description: https://datasheet.octopart.com:443/EEEFK1E470P-Panasonic-datasheet-4056.pdf?src-supplier=Farnell
D1 D2 = DIODE SCHOTTKY 40V 5A: Diode Schottky 40 V 5A Surface Mount SMA; Voltage - DC Reverse (Vr) (Max): 40 V; Voltage - Forward (Vf) (Max) @ If: 550 mV @ 5 A; Speed: Fast Recovery =< 500ns, > 200mA (Io); Current - Reverse Leakage @ Vr: 1 mA @ 40 V; Capacitance @ Vr, F: 500pF @ 4V, 1MHz; Current - Average Rectified (Io): 5A; Mounting Type: Surface Mount; Package / Case: DO-214AC, SMA; Operating Temperature - Junction: -55°C ~ 125°C; ComponentLink1Description: DataSheet; ComponentLink1URL: https://www.digikey.com/en/products/detail/mdd/ss54/15911594#:~:text=Datasheets-,SS54_Datasheet,-Environmental%20%26%20Export%20Classifications; ComponentLink2Description: Supplier Link; ComponentLink2URL: https://www.digikey.com/en/products/detail/mdd/ss54/15911594
D3 = LED RED CLEAR: Red 631nm LED Indication - Discrete 2V 0603 (1608 Metric); Manufacturer: Lite-On; Value: 100µF; Forward Current: 25mA; Forward Voltage: 2.4V; Lens Color: Clear, Colorless; Lens Style: Clear; Luminous Intensity: 18mcd; Number of Circuits: 1; Peak Wavelength: 639nm; Power Dissipation: 62.5mW; Power Rating: 75mW; Reverse Voltage: 5V; Shape: Rectangular; Test Current: 20mA; Tolerance: 20%; Viewing Angle: 260°; Voltage Rating: 50V; Supplier: Future Electronics; Supplier Part Number: 5050042; Manufacturer Part Number: LTST-C190KRKT; RoHS: Compliant; Category: LEDs; Stock: 1444000; Pricing: 4000=0,0152, 12000=0,0149, 20000=0,0147, 60000=0,0144, 100000=0,014 (USD); Case/Package: 0603; Case Code (Imperial): 0603; Case Code (Metric): 1608; China RoHS: Compliant; Color: Red; Depth: 800µm; Diameter: 8mm; Dominant Wavelength: 631nm; Height: 800µm; Illumination Color: Red; Lead Free: Lead Free; Lead Pitch: 3.5mm; Length: 11.5mm; Lens Transparency: Clear; Lifecycle Status: Production; Max Operating Temperature: 85°C; Min Operating Temperature: -30°C; Mounting Technology: Surface Mount; Number of Elements: 1; Number of LEDs: 1; Pins: 2; Number of Terminals: 2; Packaging: Bulk; Radiation Hardening: No; REACH SVHC: Yes; Schedule B: 8541402000, 8541402000|8541402000, 8541402000|8541402000|8541402000, 8541402000|8541402000|8541402000|8541402000; Voltage Rating (DC): 50V; Wavelength: 631nm; Width: 800µm; ComponentLink1URL: https://datasheet.octopart.com:443/LTST-C190KRKT-Lite-On-datasheet-32047000.pdf?src-supplier=Upverter; ComponentLink1Description: https://datasheet.octopart.com:443/LTST-C190KRKT-Lite-On-datasheet-32047000.pdf?src-supplier=Upverter; ComponentLink2URL: https://datasheet.octopart.com:443/LTST-C190KRKT-Lite-On-datasheet-114749306.pdf?src-supplier=ODG+(Origin+Data+Global); ComponentLink2Description: https://datasheet.octopart.com:443/LTST-C190KRKT-Lite-On-datasheet-114749306.pdf?src-supplier=ODG+(Origin+Data+Global); ComponentLink3URL: https://datasheet.octopart.com:443/LTST-C190KRKT-Lite-On-datasheet-166650849.pdf?src-supplier=IHS; ComponentLink3Description: https://datasheet.octopart.com:443/LTST-C190KRKT-Lite-On-datasheet-166650849.pdf?src-supplier=IHS; ComponentLink4URL: https://datasheet.octopart.com:443/LTST-C190KRKT-Lite-On-datasheet-158191.pdf?src-supplier=_legacy+Avnet; ComponentLink4Description: https://datasheet.octopart.com:443/LTST-C190KRKT-Lite-On-datasheet-158191.pdf?src-supplier=_legacy+Avnet; ComponentLink5URL: https://datasheet.octopart.com:443/LTST-C190KRKT-Lite-On-datasheet-165573809.pdf?src-supplier=TME; ComponentLink5Description: https://datasheet.octopart.com:443/LTST-C190KRKT-Lite-On-datasheet-165573809.pdf?src-supplier=TME; ComponentLink6URL: https://datasheet.octopart.com:443/LTST-C190KRKT-Lite-On-datasheet-165573808.pdf?src-supplier=TME; ComponentLink6Description: https://datasheet.octopart.com:443/LTST-C190KRKT-Lite-On-datasheet-165573808.pdf?src-supplier=TME; ComponentLink7URL: https://datasheet.octopart.com:443/LTST-C190KRKT-Lite-On-datasheet-12557188.pdf?src-supplier=Future+Electronics; ComponentLink7Description: https://datasheet.octopart.com:443/LTST-C190KRKT-Lite-On-datasheet-12557188.pdf?src-supplier=Future+Electronics; ComponentLink8URL: https://datasheet.octopart.com:443/LTST-C190KRKT-Lite-On-datasheet-8329900.pdf?src-supplier=Future+Electronics; ComponentLink8Description: https://datasheet.octopart.com:443/LTST-C190KRKT-Lite-On-datasheet-8329900.pdf?src-supplier=Future+Electronics; ComponentLink9URL: https://datasheet.octopart.com:443/LTST-C190KRKT-Lite-On-datasheet-8319956.pdf?src-supplier=Jameco; ComponentLink9Description: https://datasheet.octopart.com:443/LTST-C190KRKT-Lite-On-datasheet-8319956.pdf?src-supplier=Jameco; ComponentLink10URL: https://datasheet.octopart.com:443/LTST-C190KRKT-Lite-On-datasheet-94958.pdf?src-supplier=DigiKey; ComponentLink10Description: https://datasheet.octopart.com:443/LTST-C190KRKT-Lite-On-datasheet-94958.pdf?src-supplier=DigiKey
D4 = DIODE TVS 40VC: TVS Diode, SMBJ, Unidirectional, 24 V, 38.9 V, DO-214AA (SMB), 2 Pins; Manufacturer: Bourns; Breakdown Voltage: 28.1V; Clamping Voltage: 38.9V; Element Configuration: Single; ESD Protection: Yes; Leakage Current: 5µA; Max Breakdown Voltage: 29.5V; Max Junction Temperature (Tj): 150°C; Max Power Dissipation: 5W; Max Surge Current: 100A; Min Breakdown Voltage: 26.7V; Number of Channels: 1; Peak Pulse Current: 15.5A; Peak Pulse Power: 600W; Power Line Protection: No; Reverse Standoff Voltage: 24V; Test Current: 1mA; Supplier: Farnell; Supplier Part Number: 1899465; RoHS: Compliant; Category: TVS Diodes; Stock: 35659; Pricing: 5=0,345, 10=0,226, 100=0,11, 500=0,108, 1000=0,103, 5000=0,083 (EUR); Case/Package: SMB; China RoHS: Non-Compliant; Composition: Zener; Direction: Unidirectional; Height: 2.44mm; Length: 4.57mm; Lifecycle Status: Production; Max Operating Temperature: 150°C; Max Reverse Leakage Current: 5µA; Min Operating Temperature: -55°C; Mounting Technology: Surface Mount; Number of Elements: 1; Pins: 2; Number of Terminals: 2; Number of Unidirectional Channels: 1; Packaging: Tape & Reel; Polarity: Unidirectional; Radiation Hardening: No; REACH SVHC: No; Reverse Breakdown Voltage: 26.7V; Schedule B: 8541100080; Termination: SMD/SMT; Width: 3.94mm; ComponentLink1URL: https://datasheet.octopart.com:443/SMBJ24A-Bourns-datasheet-179980059.pdf?src-supplier=TME; ComponentLink1Description: https://datasheet.octopart.com:443/SMBJ24A-Bourns-datasheet-179980059.pdf?src-supplier=TME; ComponentLink2URL: https://datasheet.octopart.com:443/SMBJ24A-Bourns-datasheet-12567566.pdf?src-supplier=Burklin+Elektronik; ComponentLink2Description: https://datasheet.octopart.com:443/SMBJ24A-Bourns-datasheet-12567566.pdf?src-supplier=Burklin+Elektronik; ComponentLink3URL: https://datasheet.octopart.com:443/SMBJ24A-Bourns-datasheet-165058450.pdf?src-supplier=Burklin+Elektronik; ComponentLink3Description: https://datasheet.octopart.com:443/SMBJ24A-Bourns-datasheet-165058450.pdf?src-supplier=Burklin+Elektronik; ComponentLink4URL: https://datasheet.octopart.com:443/SMBJ24A-Bourns-datasheet-94099898.pdf?src-supplier=Farnell; ComponentLink4Description: https://datasheet.octopart.com:443/SMBJ24A-Bourns-datasheet-94099898.pdf?src-supplier=Farnell; ComponentLink5URL: https://datasheet.octopart.com:443/SMBJ24A-Bourns-datasheet-34433208.pdf?src-supplier=Newark; ComponentLink5Description: https://datasheet.octopart.com:443/SMBJ24A-Bourns-datasheet-34433208.pdf?src-supplier=Newark; ComponentLink6URL: https://datasheet.octopart.com:443/SMBJ24A-Bourns-datasheet-154729896.pdf?src-supplier=Electro+Sonic; ComponentLink6Description: https://datasheet.octopart.com:443/SMBJ24A-Bourns-datasheet-154729896.pdf?src-supplier=Electro+Sonic; ComponentLink7URL: https://datasheet.octopart.com:443/SMBJ24A-Bourns-datasheet-42429174.pdf?src-supplier=RS+(Formerly+Allied+Electronics); ComponentLink7Description: https://datasheet.octopart.com:443/SMBJ24A-Bourns-datasheet-42429174.pdf?src-supplier=RS+(Formerly+Allied+Electronics); ComponentLink8URL: https://datasheet.octopart.com:443/SMBJ24A-Bourns-datasheet-10292148.pdf?src-supplier=element14; ComponentLink8Description: https://datasheet.octopart.com:443/SMBJ24A-Bourns-datasheet-10292148.pdf?src-supplier=element14; ComponentLink9URL: https://datasheet.octopart.com:443/SMBJ24A-Bourns-datasheet-14047909.pdf?src-supplier=iiiC; ComponentLink9Description: https://datasheet.octopart.com:443/SMBJ24A-Bourns-datasheet-14047909.pdf?src-supplier=iiiC; ComponentLink10URL: http://sigma.octopart.com:80/conflict_mineral_statement/Bourns-company-36.pdf?src-supplier=Compliance+Statements; ComponentLink10Description: http://sigma.octopart.com:80/conflict_mineral_statement/Bourns-company-36.pdf?src-supplier=Compliance+Statements; Manufacturer Part Number: SMBJ24A
L1 = INDUCTOR 33UH: INDUCT ARRAY 2 COIL 33UH SMD; Manufacturer: Bourns; Core Material: Ferrite; Current: 653mA; DC Resistance (DCR): 240mΩ; Inductance - Series: 132µH; Inductance Tolerance: 20%; Max Current Rating: 1.31A; Number of Circuits: 2; Self Resonant Frequency: 100kHz; Shielding: Yes; Supplier: Arrow Electronics; Supplier Part Number: SRF0703-330M; Manufacturer Part Number: SRF0703-330M; RoHS: Compliant; Category: Fixed Inductors; Stock: 70; Pricing: 70=0,3829 (USD); Case/Package: 3030; China RoHS: Compliant; Depth: 7.6mm; Height: 3.4mm; Inductance - Parallel: 33µH; Length: 7.6mm; Lifecycle Status: Production; Max DC Current: 1.31A; Max Operating Temperature: 125°C; Military Standard: Not; Min Operating Temperature: -40°C; Mounting Technology: Surface Mount; Number of Coils: 2; Pins: 4; Number of Terminals: 4; Packaging: Cut Tape; REACH SVHC: Yes; RMS Current (Irms): 1.31A; Schedule B: 8504500000, 8504500000|8504500000|8504500000|8504500000|8504500000; Termination: SMD/SMT; Test Frequency: 100kHz; Tolerance: 20%; Width: 7.6mm; ComponentLink1URL: https://datasheet.octopart.com:443/SRF0703-330M-Bourns-datasheet-166810714.pdf?src-supplier=IHS; ComponentLink1Description: https://datasheet.octopart.com:443/SRF0703-330M-Bourns-datasheet-166810714.pdf?src-supplier=IHS; ComponentLink2URL: https://datasheet.octopart.com:443/SRF0703-330M-Bourns-datasheet-13693259.pdf?src-supplier=element14+APAC; ComponentLink2Description: https://datasheet.octopart.com:443/SRF0703-330M-Bourns-datasheet-13693259.pdf?src-supplier=element14+APAC; ComponentLink3URL: https://datasheet.octopart.com:443/SRF0703-330M-Bourns-datasheet-154729902.pdf?src-supplier=Electro+Sonic; ComponentLink3Description: https://datasheet.octopart.com:443/SRF0703-330M-Bourns-datasheet-154729902.pdf?src-supplier=Electro+Sonic; ComponentLink4URL: https://datasheet.octopart.com:443/SRF0703-330M-Bourns-datasheet-159777445.pdf?src-supplier=RS+(Formerly+Allied+Electronics); ComponentLink4Description: https://datasheet.octopart.com:443/SRF0703-330M-Bourns-datasheet-159777445.pdf?src-supplier=RS+(Formerly+Allied+Electronics); ComponentLink5URL: https://datasheet.octopart.com:443/SRF0703-330M-Bourns-datasheet-10413855.pdf?src-supplier=Newark; ComponentLink5Description: https://datasheet.octopart.com:443/SRF0703-330M-Bourns-datasheet-10413855.pdf?src-supplier=Newark; ComponentLink6URL: https://datasheet.octopart.com:443/SRF0703-330M-Bourns-datasheet-10025696.pdf?src-supplier=Farnell; ComponentLink6Description: https://datasheet.octopart.com:443/SRF0703-330M-Bourns-datasheet-10025696.pdf?src-supplier=Farnell; ComponentLink7URL: http://sigma.octopart.com:80/conflict_mineral_statement/Bourns-company-36.pdf?src-supplier=Compliance+Statements; ComponentLink7Description: http://sigma.octopart.com:80/conflict_mineral_statement/Bourns-company-36.pdf?src-supplier=Compliance+Statements
R1 = RES 31K OHM 1/2W 2010: 31 kOhms ±0.01% 0.5W, 1/2W Chip Resistor 2010 (5025 Metric) Non-Inductive Metal Foil; Manufacturer: Vishay; Power Dissipation: 500mW; Temperature Coefficient: 0.2ppm/°C; Working Voltage: 187V; Supplier: Avnet; Supplier Part Number: Y162731K0000T9R; Manufacturer Part Number: Y162731K0000T9R; RoHS: Compliant; Category: Chip SMD Resistors; Pricing: 100=21,3857, 200=21,0735, 400=15,5876, 600=14,3969, 800=14,1771 (USD); Height: 640µm; Lifecycle Status: EOL; Max Operating Temperature: 150°C; Min Operating Temperature: -55°C; Mounting Technology: Surface Mount; Number of Terminals: 2; REACH SVHC: Yes; Tolerance: 0.01%; Width: 2.46mm; ComponentLink1URL: https://datasheet.octopart.com:443/Y162731K0000T9R-Vishay-Precision-Group-datasheet-182188935.pdf?src-supplier=IHS; ComponentLink1Description: https://datasheet.octopart.com:443/Y162731K0000T9R-Vishay-Precision-Group-datasheet-182188935.pdf?src-supplier=IHS; ComponentLink2URL: http://sigma.octopart.com:80/rohs_statement/Vishay-company-15.pdf?src-supplier=Compliance+Statements; ComponentLink2Description: http://sigma.octopart.com:80/rohs_statement/Vishay-company-15.pdf?src-supplier=Compliance+Statements